# EAGLE design pCog101_Wifi_Remote_TFT (EAGLE 6.6.0)

## Sheet 1 of 4
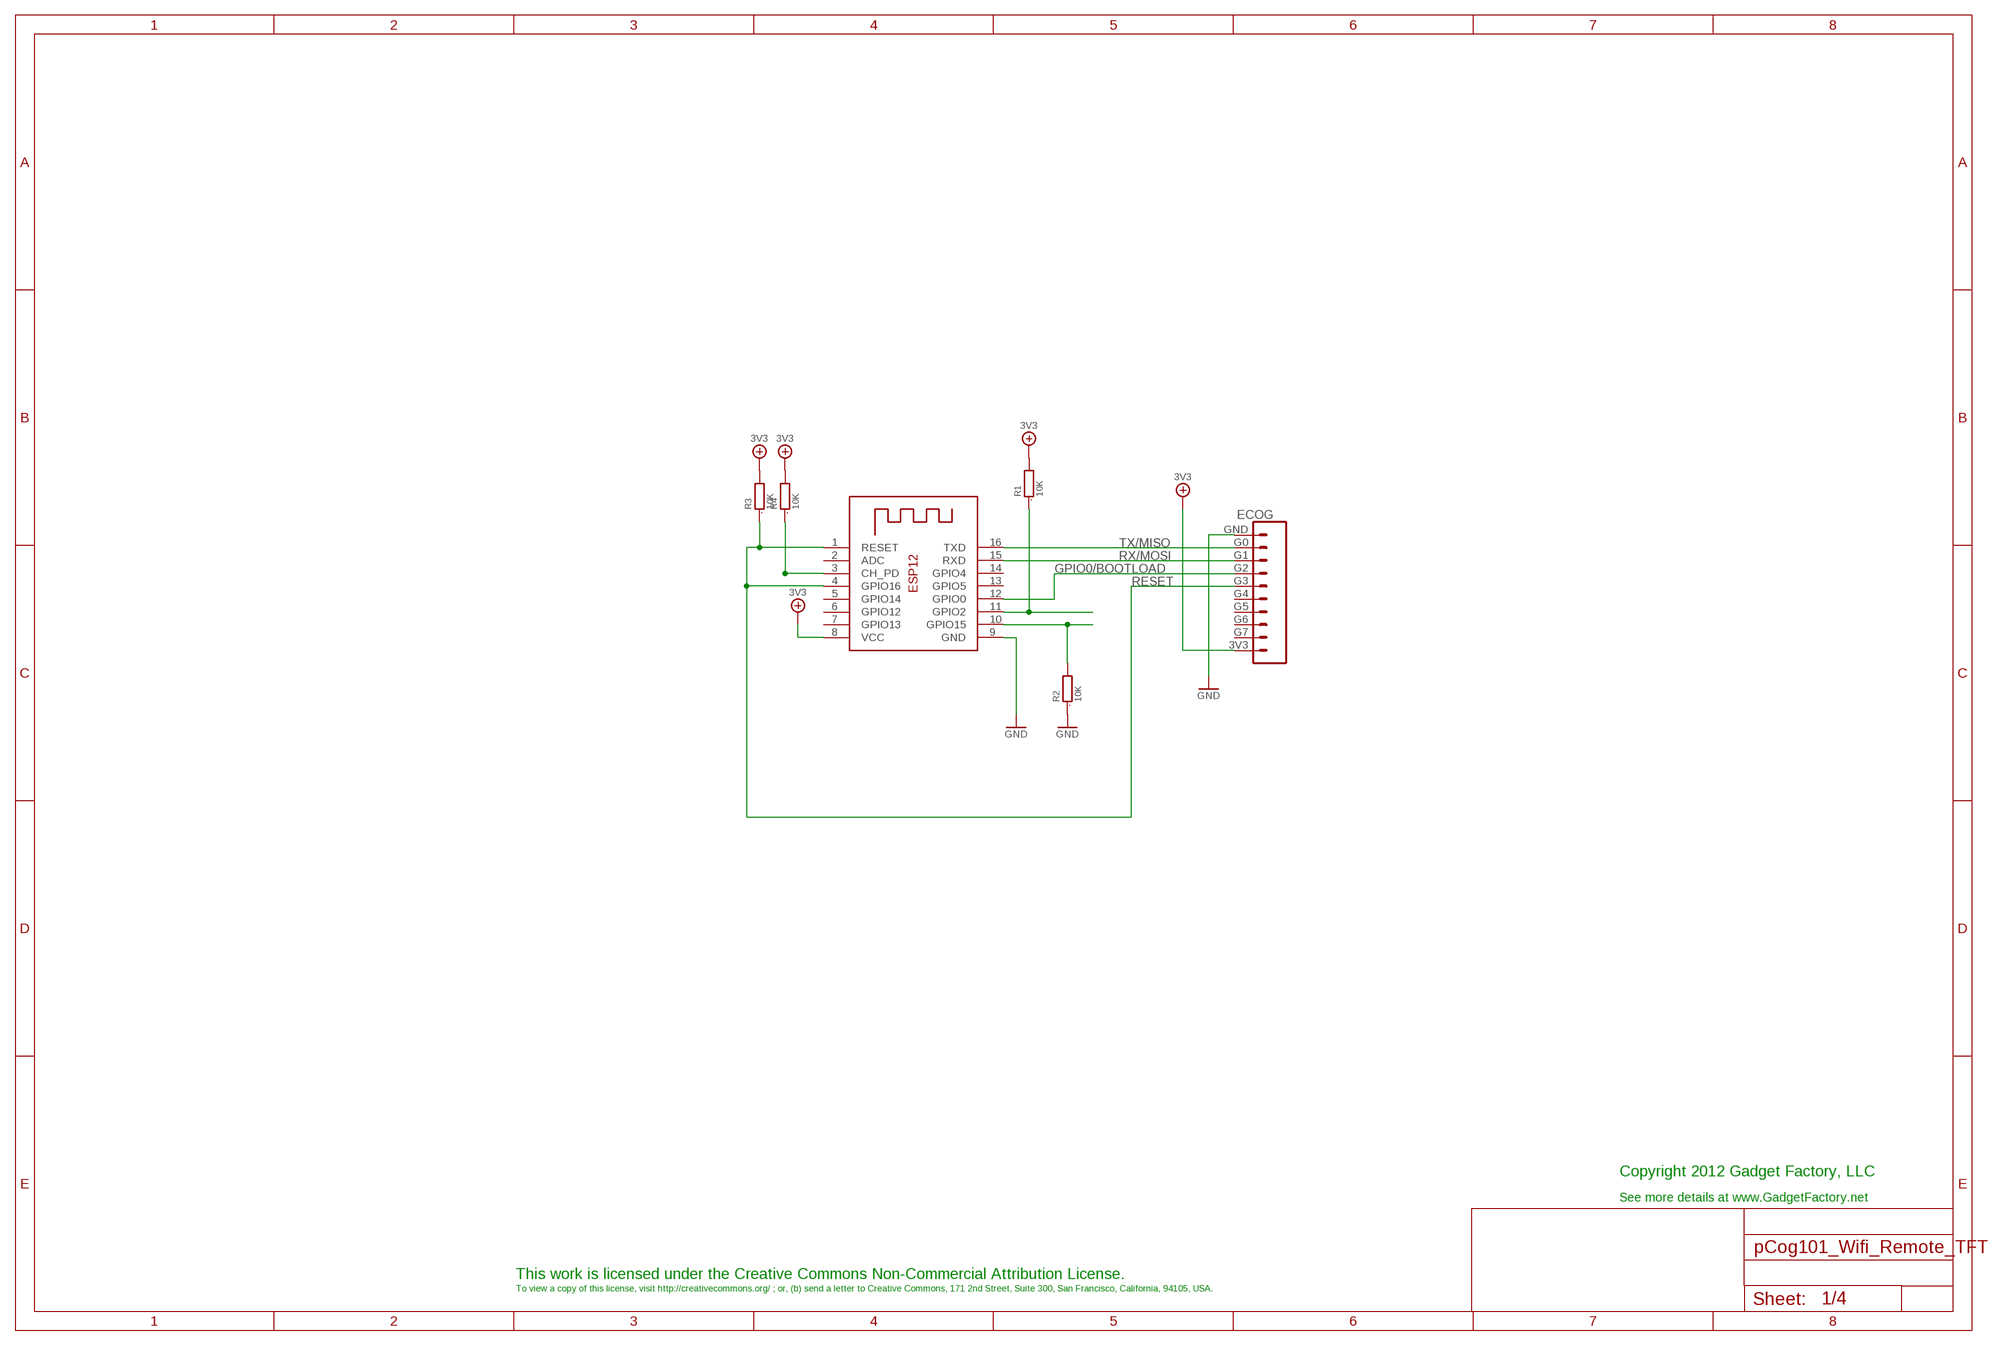
[diagram p0: schematic, sheet 1]

### Parts
ECOG  ECOG_GENERAL_ROWTHROUGHOLE  [ECOG_GENERAL_TH]
R1  10K  R0805  [0805]
R2  10K  R0805  [0805]
R3  10K  R0805  [0805]
R4  10K  R0805  [0805]
X1  ESP-12  [ESP-12]

### Nets
3V3: ECOG.3V3 R1.2 R3.2 R4.2 X1.8(VCC) ; also sheet 2,3,4
GND: ECOG.GND R2.1 X1.9(GND) ; also sheet 2,3,4
GPIO0/BOOTLOAD: ECOG.G2 X1.12(GPIO0)
N$3: R1.1 X1.11(GPIO2)
N$4: R2.2 X1.10(GPIO15)
N$5: R4.1 X1.3(CH_PD)
RESET: ECOG.G3 R3.1 X1.1(RESET) X1.4(GPIO16)
RX/MOSI: ECOG.G1 X1.15(RXD)
TX/MISO: ECOG.G0 X1.16(TXD)
Unconnected: ECOG.G4 ECOG.G5 ECOG.G6 ECOG.G7 X1.2(ADC) X1.5(GPIO14) X1.6(GPIO12) X1.7(GPIO13) X1.13(GPIO5) X1.14(GPIO4)

### Notes on the sheet
- Copyright 2012 Gadget Factory, LLC
- See more details at www.GadgetFactory.net
- This work is licensed under the Creative Commons Non-Commercial Attribution License.
- To view a copy of this license, visit http://creativecommons.org/ ; or, (b) send a letter to Creative Commons, 171 2nd Street, Suite 300, San Francisco, California, 94105, USA.

## Sheet 2 of 4
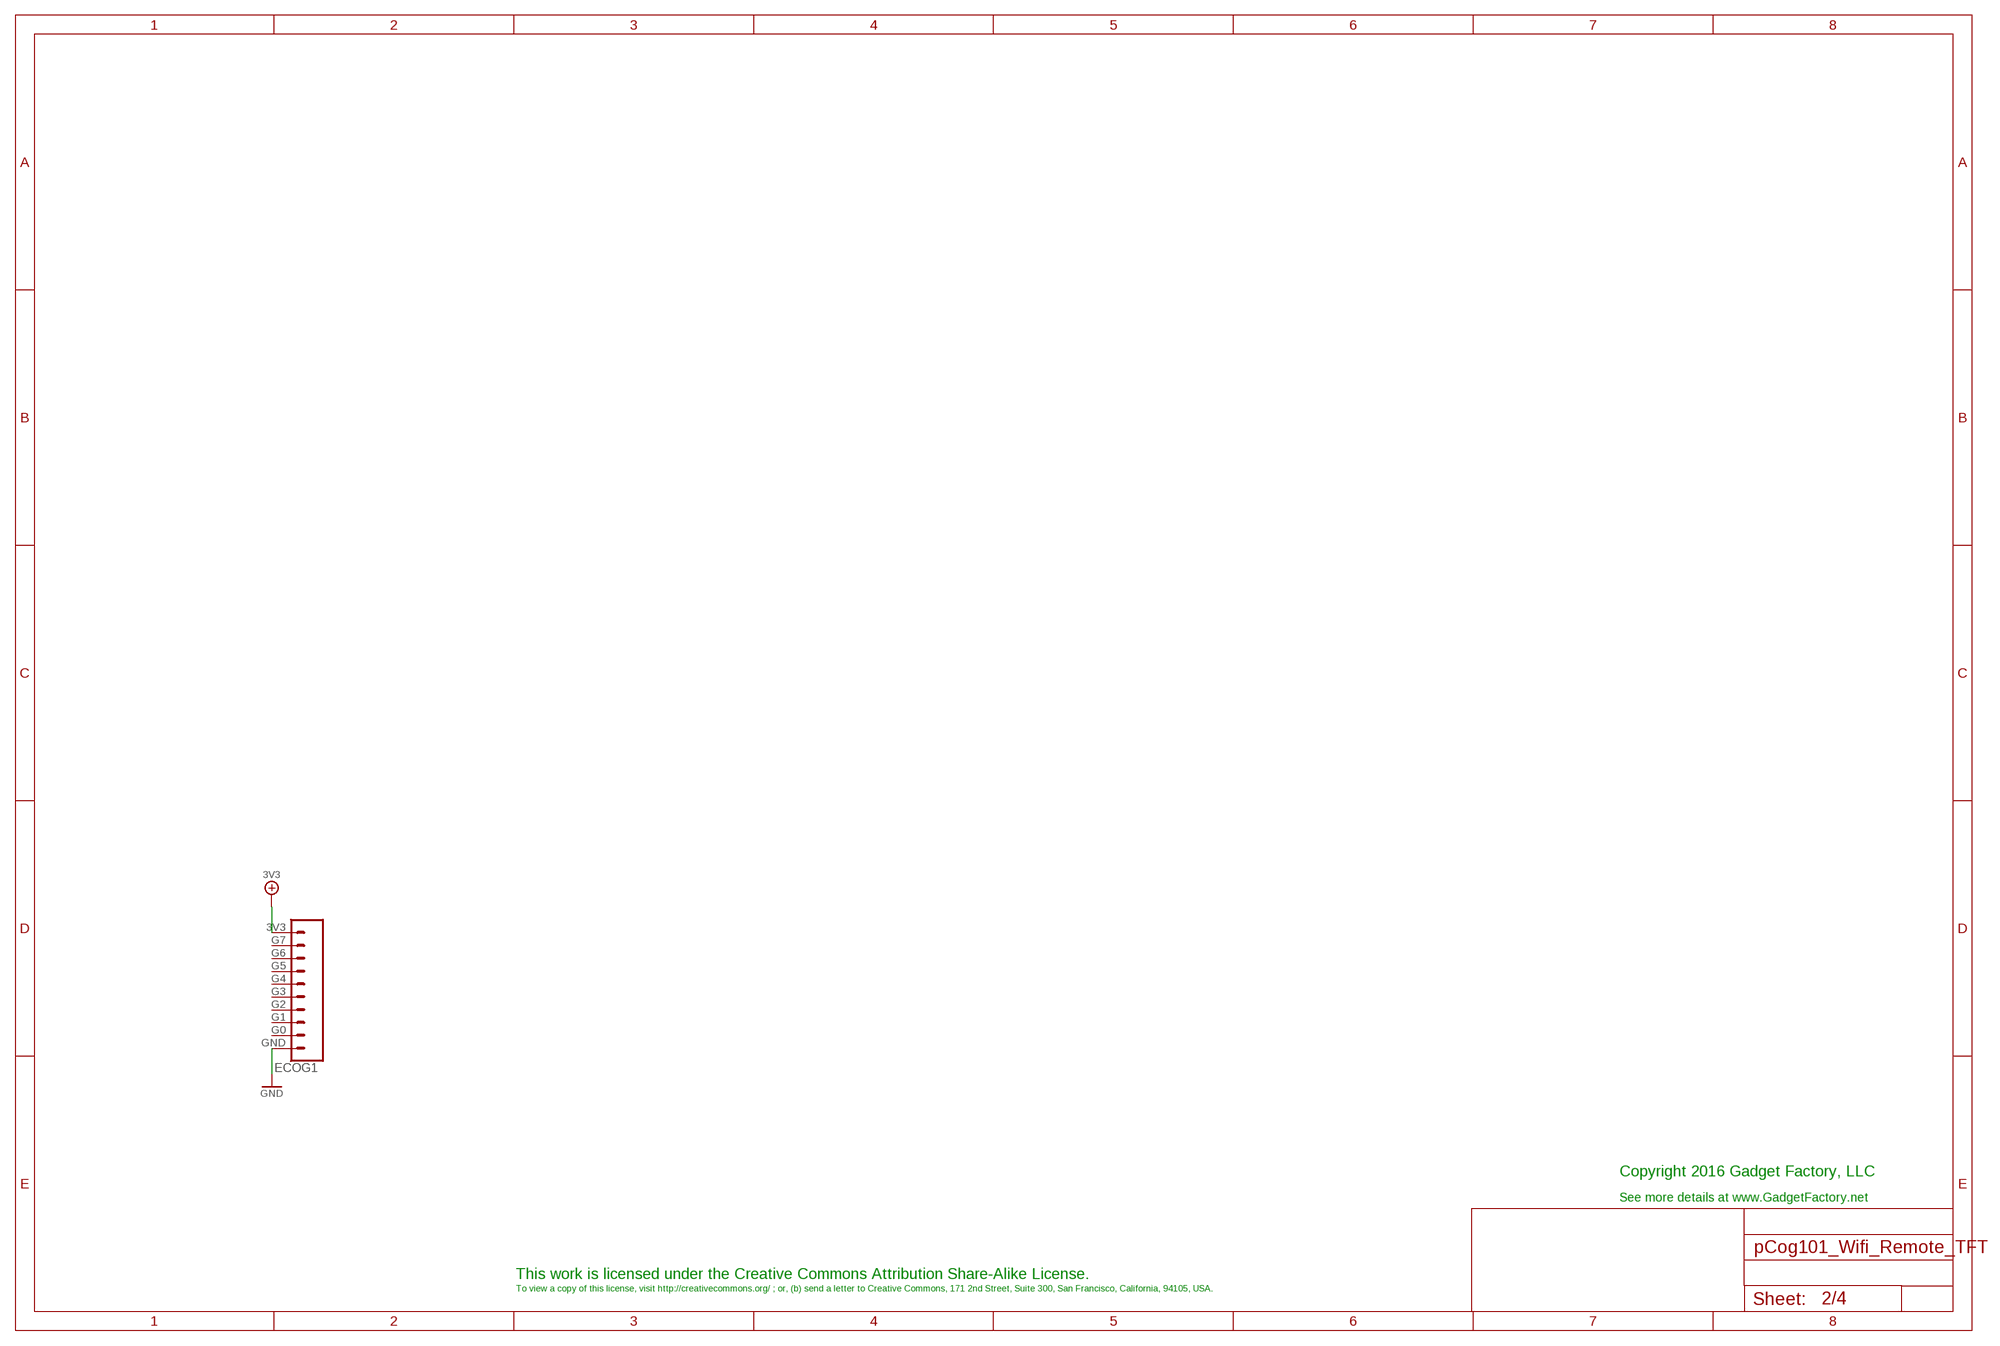
[diagram p1: schematic, sheet 2]

### Parts
ECOG1  ECOG_GENERAL_ROWSURFACEMOUNT  [ECOG_GENERAL_SMD]

### Nets
3V3: ECOG1.3V3 ; also sheet 1,3,4
GND: ECOG1.GND ; also sheet 1,3,4
Unconnected: ECOG1.G0 ECOG1.G1 ECOG1.G2 ECOG1.G3 ECOG1.G4 ECOG1.G5 ECOG1.G6 ECOG1.G7

### Notes on the sheet
- Copyright 2016 Gadget Factory, LLC
- See more details at www.GadgetFactory.net
- This work is licensed under the Creative Commons Attribution Share-Alike License.
- To view a copy of this license, visit http://creativecommons.org/ ; or, (b) send a letter to Creative Commons, 171 2nd Street, Suite 300, San Francisco, California, 94105, USA.

## Sheet 3 of 4
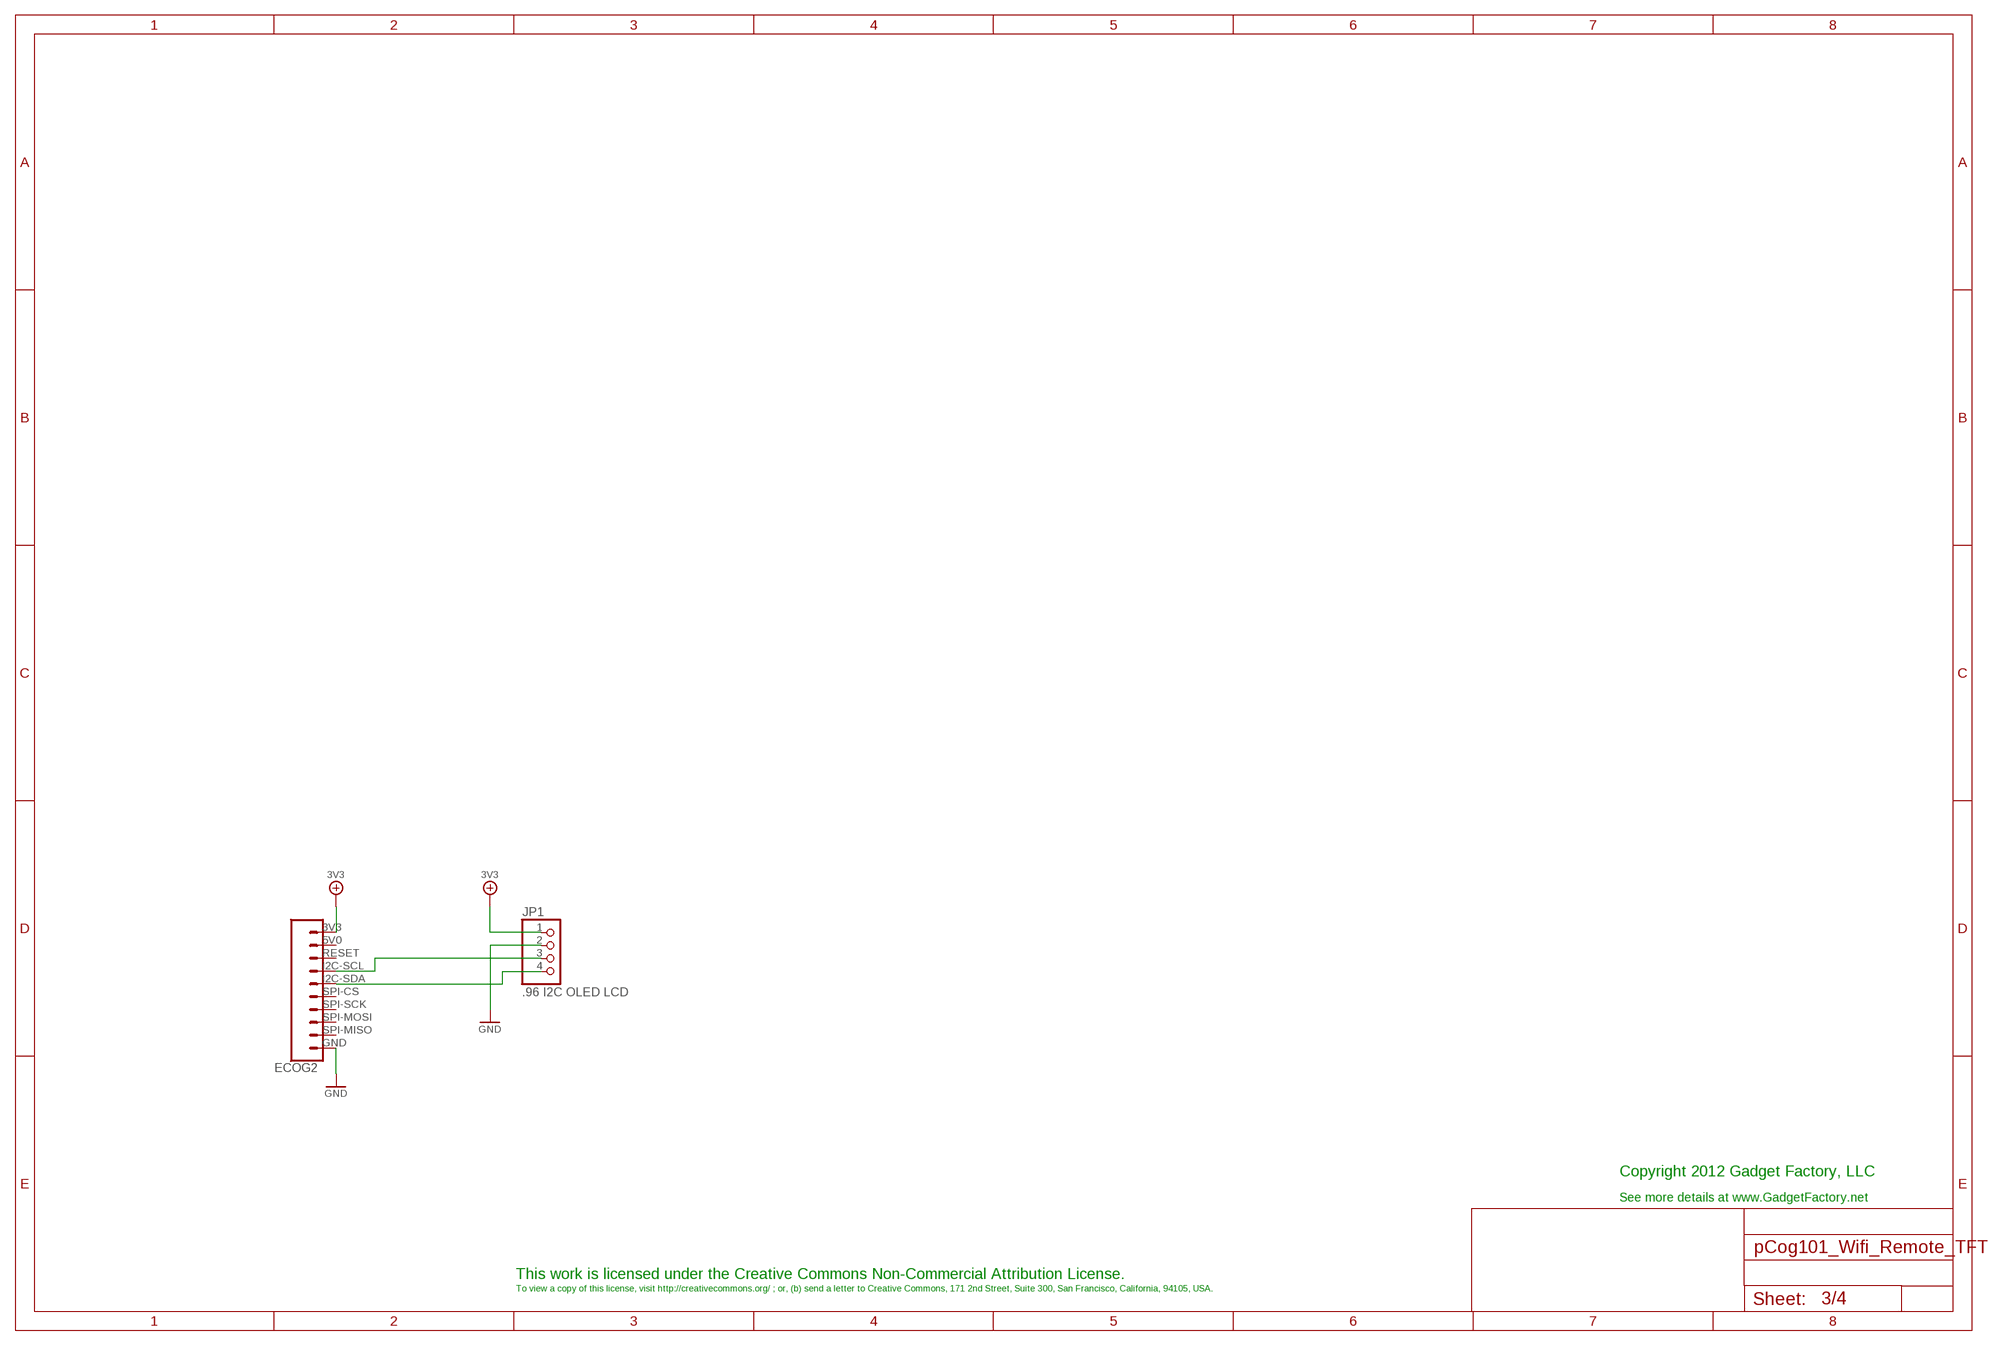
[diagram p2: schematic, sheet 3]

### Parts
ECOG2  ECOG_BUSES_ROWTHROUGHHOLE  [ECOG_BUSES_TH]
JP1  .96 I2C OLED LCD  PINHD-1X4  [1X04]

### Nets
3V3: ECOG2.3V3 JP1.1 ; also sheet 1,2,4
GND: ECOG2.GND JP1.2 ; also sheet 1,2,4
N$1: ECOG2.I2C-SCL JP1.3
N$2: ECOG2.I2C-SDA JP1.4
Unconnected: ECOG2.5V0(RSV) ECOG2.RESET(RSV) ECOG2.SPI-CS ECOG2.SPI-MISO ECOG2.SPI-MOSI ECOG2.SPI-SCK

### Notes on the sheet
- Copyright 2012 Gadget Factory, LLC
- See more details at www.GadgetFactory.net
- This work is licensed under the Creative Commons Non-Commercial Attribution License.
- To view a copy of this license, visit http://creativecommons.org/ ; or, (b) send a letter to Creative Commons, 171 2nd Street, Suite 300, San Francisco, California, 94105, USA.

## Sheet 4 of 4
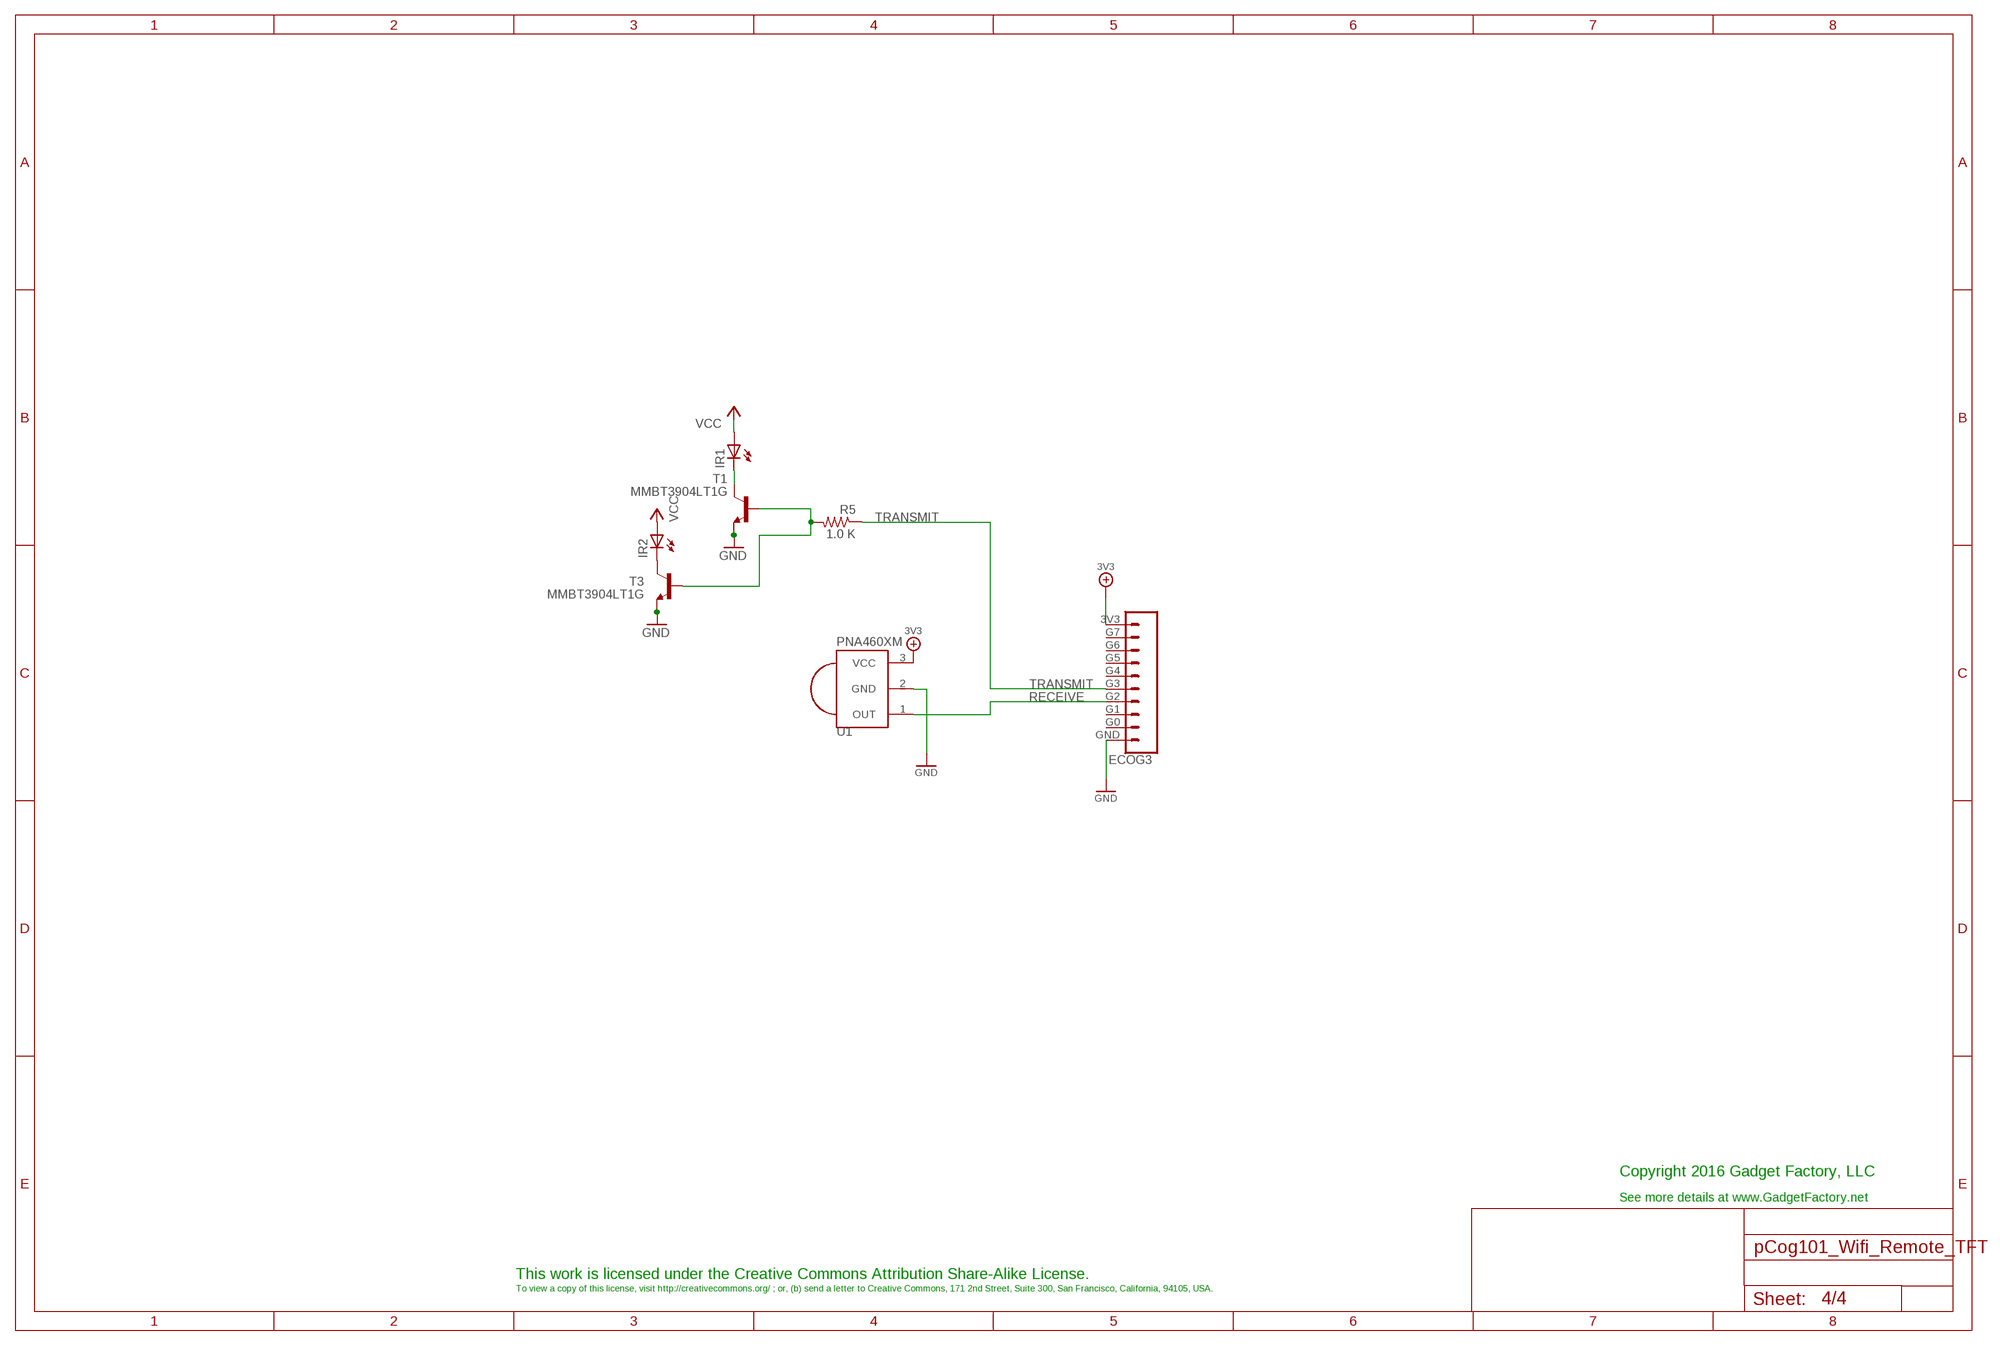
[diagram p3: schematic, sheet 4]

### Parts
ECOG3  ECOG_GENERAL_ROWTHROUGHOLE  [ECOG_GENERAL_TH]
IR1  LED5MM  [LED5MM]
IR2  LED5MM  [LED5MM]
R5  1.0 K  R-US_R0805  [R0805]
T1  MMBT3904LT1G  MMBT3904LT1-NPN-SOT23-BEC  [SOT23-BEC]
T3  MMBT3904LT1G  MMBT3904LT1-NPN-SOT23-BEC  [SOT23-BEC]
U1  PNA460XM  [PNA460XM]

### Nets
3V3: ECOG3.3V3 IR1.A IR2.A U1.3(VCC) ; supply symbol labelled VCC ; also sheet 1,2,3
GND: ECOG3.GND T1.E T3.E U1.2(GND) ; also sheet 1,2,3
N$7: IR1.K(C) T1.C
N$9: IR2.K(C) T3.C
N$10: R5.2 T1.B T3.B
RECEIVE: ECOG3.G2 U1.1(OUT)
TRANSMIT: ECOG3.G3 R5.1
Unconnected: ECOG3.G0 ECOG3.G1 ECOG3.G4 ECOG3.G5 ECOG3.G6 ECOG3.G7

### Notes on the sheet
- Copyright 2016 Gadget Factory, LLC
- See more details at www.GadgetFactory.net
- This work is licensed under the Creative Commons Attribution Share-Alike License.
- To view a copy of this license, visit http://creativecommons.org/ ; or, (b) send a letter to Creative Commons, 171 2nd Street, Suite 300, San Francisco, California, 94105, USA.

## Library data of the parts
ECOG ECOG3 = eCogs:ECOG_GENERAL_ROW
ECOG1 = eCogs:ECOG_GENERAL_ROW; DIGIKEY: S1013EC-10-ND
ECOG2 = eCogs:ECOG_BUSES_ROW
IR1 = adafruit:LED: LED OSRAM: - CHIPLED LG R971, LG N971, LY N971, LG Q971, LY Q971, LO R971, LY R971 LH N974, LH R974 LS Q976, LO Q976, LY Q976 LO Q996 - Hyper CHIPLED LW Q18S LB Q993, LB Q99A, LB R99A - SideLED LS A670, LO A670, LY A670, LG A670, LP A670 LB A673, LV A673, LT A673, LW A673 LH A674 LY A675 LS A676, LA A676, LO A676, LY A676, LW A676 LS A679, LY A679, LG A679 - Hyper Micro SIDELED® LS Y876, LA Y876, LO Y876, LY Y876 LT Y87S - SmartLED LW L88C, LW L88S LB L89C, LB L89S, LG L890 LS L89K, LO L89K, LY L89K LS L896, LA L896, LO L896, LY L896 - TOPLED LS T670, LO T670, LY T670, LG T670, LP T670 LSG T670, LSP T670, LSY T670, LOP T670, LYG T670 LG T671, LOG T671, LSG T671 LB T673, LV T673, LT T673, LW T673 LH T674 LS T676, LA T676, LO T676, LY T676, LB T676, LH T676, LSB T676, LW T676 LB T67C, LV T67C, LT T67C, LS T67K, LO T67K, LY T67K, LW E67C LS E67B, LA E67B, LO E67B, LY E67B, LB E67C, LV E67C, LT E67C LW T67C LS T679, LY T679, LG T679 LS T770, LO T770, LY T770, LG T770, LP T770 LB T773, LV T773, LT T773, LW T773 LH T774 LS E675, LA E675, LY E675, LS T675 LS T776, LA T776, LO T776, LY T776, LB T776 LHGB T686 LT T68C, LB T68C - Hyper Mini TOPLED® LB M676 - Mini TOPLED Santana® LG M470 LS M47K, LO M47K, LY M47K Source: http://www.osram.convergy.de/; DIGIKEY: 1080-1082-ND
IR2 = adafruit:LED: LED OSRAM: - CHIPLED LG R971, LG N971, LY N971, LG Q971, LY Q971, LO R971, LY R971 LH N974, LH R974 LS Q976, LO Q976, LY Q976 LO Q996 - Hyper CHIPLED LW Q18S LB Q993, LB Q99A, LB R99A - SideLED LS A670, LO A670, LY A670, LG A670, LP A670 LB A673, LV A673, LT A673, LW A673 LH A674 LY A675 LS A676, LA A676, LO A676, LY A676, LW A676 LS A679, LY A679, LG A679 - Hyper Micro SIDELED® LS Y876, LA Y876, LO Y876, LY Y876 LT Y87S - SmartLED LW L88C, LW L88S LB L89C, LB L89S, LG L890 LS L89K, LO L89K, LY L89K LS L896, LA L896, LO L896, LY L896 - TOPLED LS T670, LO T670, LY T670, LG T670, LP T670 LSG T670, LSP T670, LSY T670, LOP T670, LYG T670 LG T671, LOG T671, LSG T671 LB T673, LV T673, LT T673, LW T673 LH T674 LS T676, LA T676, LO T676, LY T676, LB T676, LH T676, LSB T676, LW T676 LB T67C, LV T67C, LT T67C, LS T67K, LO T67K, LY T67K, LW E67C LS E67B, LA E67B, LO E67B, LY E67B, LB E67C, LV E67C, LT E67C LW T67C LS T679, LY T679, LG T679 LS T770, LO T770, LY T770, LG T770, LP T770 LB T773, LV T773, LT T773, LW T773 LH T774 LS E675, LA E675, LY E675, LS T675 LS T776, LA T776, LO T776, LY T776, LB T776 LHGB T686 LT T68C, LB T68C - Hyper Mini TOPLED® LB M676 - Mini TOPLED Santana® LG M470 LS M47K, LO M47K, LY M47K Source: http://www.osram.convergy.de/; DIGIKEY: 1080-1080-ND
JP1 = pinhead:PINHD-1X4: PIN HEADER; DEALEXTREME: 419232
R1-R4 = GadgetFactory:R: RESISTOR, European symbol; DIGIKEY: RMCF0805JT10K0CT-ND
R5 = rcl-ez:R-US_: RESISTOR, American symbol; DIGIKEY: 311-1.0KARCT-ND
T1 T3 = transistor:*-NPN-: NPN Transistror BF959 corrected 2008.03.06; DIGIKEY: MMBT3904LT1GOSCT-ND
U1 = adafruit:PNA460XM: IR 38KHz receiver PNA4602 and related receivers http://www.ladyada.net/library/pcb/eaglelibrary.html; DIGIKEY: 751-1227-ND
X1 = adafruit:ESP-12; ADAFRUIT: 2491

## Board
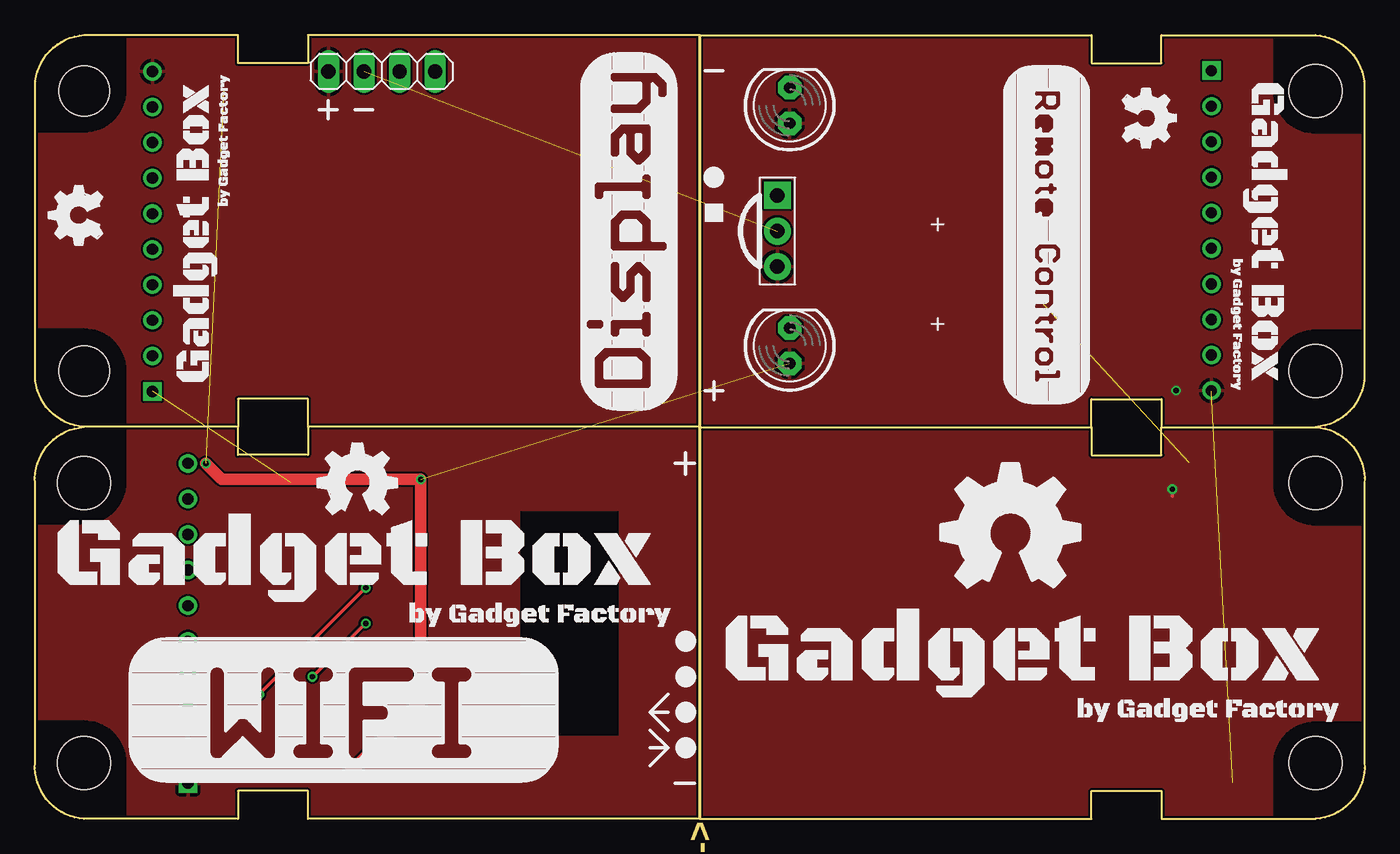
[diagram p4: board, top side]
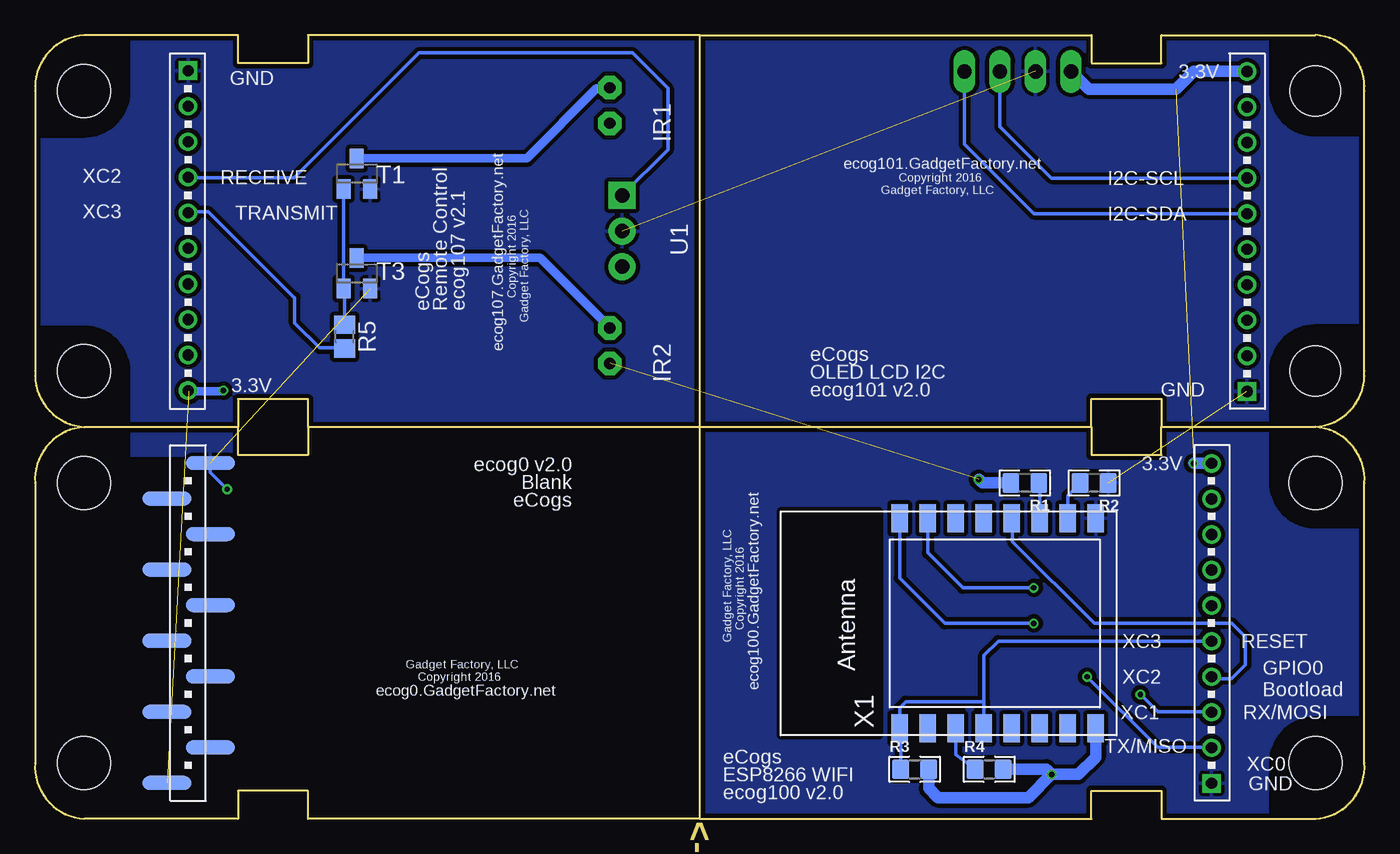
[diagram p5: board, bottom side, seen from below]

Size 95.01 x 56 mm. Coordinates in mm from the lower left corner, seen from the top.
Copper layers (1*16): Top 0.035mm / dielectric 1.5mm / Bottom 0.035mm
Design rules "hackvana": minimum track width 6mil, minimum drill 0.3mm, track to track 6mil, track to pad 6mil, pad to pad 6mil, via to via 6mil, smd to smd 0mil, copper to edge 6mil, drill to drill 6mil, minimum pad ring 10mil, minimum via ring 6mil, stop-mask expansion 2mil, vias tented up to drill 100mil, thermal gap 10mil

### Footprints (pad centres in the part's own frame; a part is rotated, then mirrored left to right if it is on the bottom)
ECOG_GENERAL_TH = drill 0.8: 3V3 11.43,25.4; G0 11.43,5.08; G1 11.43,7.62; G2 11.43,10.16; G3 11.43,12.7; G4 11.43,15.24; G5 11.43,17.78; G6 11.43,20.32; G7 11.43,22.86 | drill 0.8 square: GND 11.43,2.54 | hole 3.8: 4,24; 4,4
ECOG_GENERAL_SMD = smd 3.5 x 1 bottom: 3V3 9.923,25.429; G0 9.923,5.111; G1 13.022,7.649; G2 9.923,10.189; G3 13.022,12.729; G4 9.923,15.269; G5 13.022,17.809; G6 9.923,20.349; G7 13.022,22.889; GND 13.022,2.571 | hole 3.8: 4,24; 4,4
ECOG_BUSES_TH = drill 0.8: 3V3 8.89,25.4; 5V0 8.89,22.86; I2C-SCL 8.89,17.78; I2C-SDA 8.89,15.24; RESET 8.89,20.32; SPI-CS 8.89,12.7; SPI-MISO 8.89,5.08; SPI-MOSI 8.89,7.62; SPI-SCK 8.89,10.16 | drill 0.8 square: GND 8.89,2.54 | hole 3.6: 4.004,24.003; 4.004,4.003
LED5MM = drill 0.813 pad 1.676 octagon: A -1.27,0; K 1.27,0
1X04 = drill 1.016 long: 1 -3.81,0; 2 -1.27,0; 3 1.27,0; 4 3.81,0
0805 = smd 1.2 x 1.4: 1 -1,0; 2 1,0
R0805 = smd 1.3 x 1.5: 1 -0.85,0; 2 0.85,0
SOT23-BEC = smd 1 x 1.4: B -0.95,-1.1; C 0,1.1; E 0.95,-1.1
PNA460XM = drill 1.016 pad 1.93 square: 1 -2.54,0 | drill 1.016 pad 1.93: 2 0,0; 3 2.54,0
ESP-12 = smd 2 x 1.2: 1 -7.5,4.5; 2 -7.5,2.5; 3 -7.5,0.5; 4 -7.5,-1.5; 5 -7.5,-3.5; 6 -7.5,-5.5; 7 -7.5,-7.5; 8 -7.5,-9.5; 9 7.5,-9.5; 10 7.5,-7.5; 11 7.5,-5.5; 12 7.5,-3.5; 13 7.5,-1.5; 14 7.5,0.5; 15 7.5,2.5; 16 7.5,4.5

### Placement (x,y rotation side)
ECOG  -0.49,0 0 top
ECOG1  95.51,28 180 top
ECOG2  -0.49,28 0 top
ECOG3  95.51,56 180 top
IR1  53.93,50.97 90 top
IR2  53.93,33.81 90 top
JP1  24.78,53.4 0 top
R1  24.27,24 180 bottom
R2  19.32,24 180 bottom
R3  32.15,3.56 0 bottom
R4  26.81,3.56 0 bottom
R5  72.88,34.46 90 bottom
T1  72.01,46.09 0 bottom
T3  72.01,38.98 0 bottom
U1  53.05,42 270 top
U$1  [GADGETBOX_TEXT]  22.89,18.44 0 top
U$2  [LEGEND_DIO]  46.5,12.7 0 top
U$3  [LEGEND_DIO]  46.5,10.16 0 top
U$4  [LEGEND_DIO]  46.5,7.62 0 top
U$5  [LEGEND_DIO]  46.5,5.08 0 top
U$6  [OSHW_FILLX200_NOTEXT]  20.2,21.76 0 top
U$7  [GADGETBOX_TEXT]  70.64,11.64 0 top
U$8  [OSHW_FILLX350_NOTEXT]  64.75,16.54 0 top
U$9  [GADGETBOX_SMALL]  11.53,41.9 90 top
U$10  [OSHW_FILLX150_NOTEXT]  4.81,41 90 top
U$11  [GADGETBOX_SMALL]  87.86,41.87 270 top
U$12  [OSHW_FILLX150_NOTEXT]  77.73,52.19 270 top
U$13  [LEGEND_PWM]  48.52,43.3 180 top
U$14  [LEGEND_DIO]  48.52,45.84 180 top
X1  28.72,13.97 90 bottom

### Tracks (layer width: path | path; a pad name or v marks a point on that pad's centre or on a via)
3V3  (via drill 0.38)  (3 unrouted)
  Top 0.813: v22.37,3.18 27.57,8.38 v27.57,24.26 13.35,24.26 v12.21,25.4
  Bottom 0.61: v81.54,30.6 81.56,30.57 84.05,30.57 ECOG3.3V3
  Bottom 0.813: 19.13,6.38 X1.8 19.22,4.42 20.46,3.18 v22.37,3.18 | R4.2 22.75,3.56 v22.37,3.18 | R3.2 31.15,2.18 30.5,1.53 24.02,1.53 v22.37,3.18 | R1.2 27.32,24 v27.57,24.26 | v12.21,25.4 ECOG.3V3 | JP1.1 19.7,52.13 13.48,52.13 12.21,53.4 ECOG2.3V3
  pour Top: -1.76,57.27 48.78,57.27 48.78,26.73 -1.76,26.73
  pour Top: 96.51,27 46.51,27 46.51,57 96.51,57
GND  (via drill 0.38)  (3 unrouted)
  Top 0.254: v81.28,23.55 81.28,23.05
  Bottom 0.254: ECOG1.GND 82.48,24.76 v81.28,23.55
  pour Bottom (isolate 0.305): -0.49,28 47.51,28 47.51,0 -0.49,0
  pour Top: -0.49,27.94 47.77,27.94 47.77,0 -0.49,0
  pour Top: 96.51,-1 46.51,-1 46.51,29 96.51,29
  pour Bottom (isolate 0.305): -3.03,58.54 50.05,58.54 50.05,25.46 -3.03,25.46
  pour Bottom (isolate 0.305): 97.51,26 45.51,26 45.51,58 97.51,58
GPIO0/BOOTLOAD
  Bottom 0.254: X1.12 25.16,21.42 25.16,19.81 19.32,13.97 9.48,13.97 8.51,13 8.51,11 9.51,10 10.78,10 ECOG.G2
N$1
  Bottom 0.254: ECOG2.I2C-SCL 22.37,45.78 26.05,49.46 JP1.3
N$2
  Bottom 0.254: ECOG2.I2C-SDA 23.64,43.24 28.59,48.19 JP1.4
N$3
  Bottom 0.254: X1.11 23.22,23.95 R1.1
N$4
  Bottom 0.254: X1.10 21.22,23.11 R2.2
N$5
  Bottom 0.254: X1.3 29.22,4.58 R4.1
N$7
  Bottom 0.61: T1.C 59.86,47.19 54.87,52.19 53.98,52.19 IR1.K
N$9
  Bottom 0.61: T3.C 58.94,40.08 IR2.K
N$10
  Bottom 0.254: R5.2 72.88,37.81 T3.B T1.B
RECEIVE
  Bottom 0.254: U1.1 49.79,47.8 49.79,52.19 52.33,54.73 67.57,54.73 76.48,45.81 84.05,45.81 ECOG3.G2
RESET
  Bottom 0.254: 27.19,8.38 27.19,6.5 X1.4 | R3.1 33.15,6.4 X1.1 33.22,7.95 32.78,8.38 27.19,8.38 | 27.19,8.38 27.19,11.69 26.18,12.7 ECOG.G3
RX/MOSI  (via drill 0.38)
  Top 0.254: v16.02,8.89 v23.64,16.51
  Bottom 0.254: 31.26,21.51 X1.15 31.22,19.01 28.72,16.51 v23.64,16.51 | v16.02,8.89 14.78,7.65 10.97,7.65 ECOG.G1
TRANSMIT
  Bottom 0.254: R5.1 72.92,33.65 74.68,33.65 76.46,35.43 76.46,37.24 76.5,37.24 82.63,43.38 84,43.38 ECOG3.G3
TX/MISO  (via drill 0.38)
  Top 0.254: v19.83,10.16 v23.64,13.97
  Bottom 0.254: 33.04,21.65 X1.16 33.22,17.2 29.99,13.97 v23.64,13.97 | v19.83,10.16 14.78,5.11 10.97,5.11 ECOG.G0

### Text on the board
Dimension: <----vScore | <----vScore | vScore----> | vScore---->
tPlace: + | +
bPlace: 3.3V | GND | Copyright 2016 | ecog101.GadgetFactory.net | RECEIVE | XC2 | I2C-SCL | Gadget Factory, LLC | TRANSMIT | XC3 | I2C-SDA | Copyright 2016 | ecog107 v2.1 | Remote Control | eCogs | Gadget Factory, LLC | eCogs | ecog107.GadgetFactory.net | OLED LCD I2C | 3.3V | GND | ecog101 v2.0 | ecog0 v2.0 | 3.3V | Blank | ecog100.GadgetFactory.net | eCogs | Gadget Factory, LLC | Copyright 2016 | RESET | XC3 | Gadget Factory, LLC | XC2 | ecog0.GadgetFactory.net | Copyright 2016 | GPIO0 / Bootload | RX/MOSI | XC1 | TX/MISO | eCogs | XC0 | ESP8266 WIFI | GND | ecog100 v2.0